# Altium schematic sheet NumatoConnection.SchDoc
size B
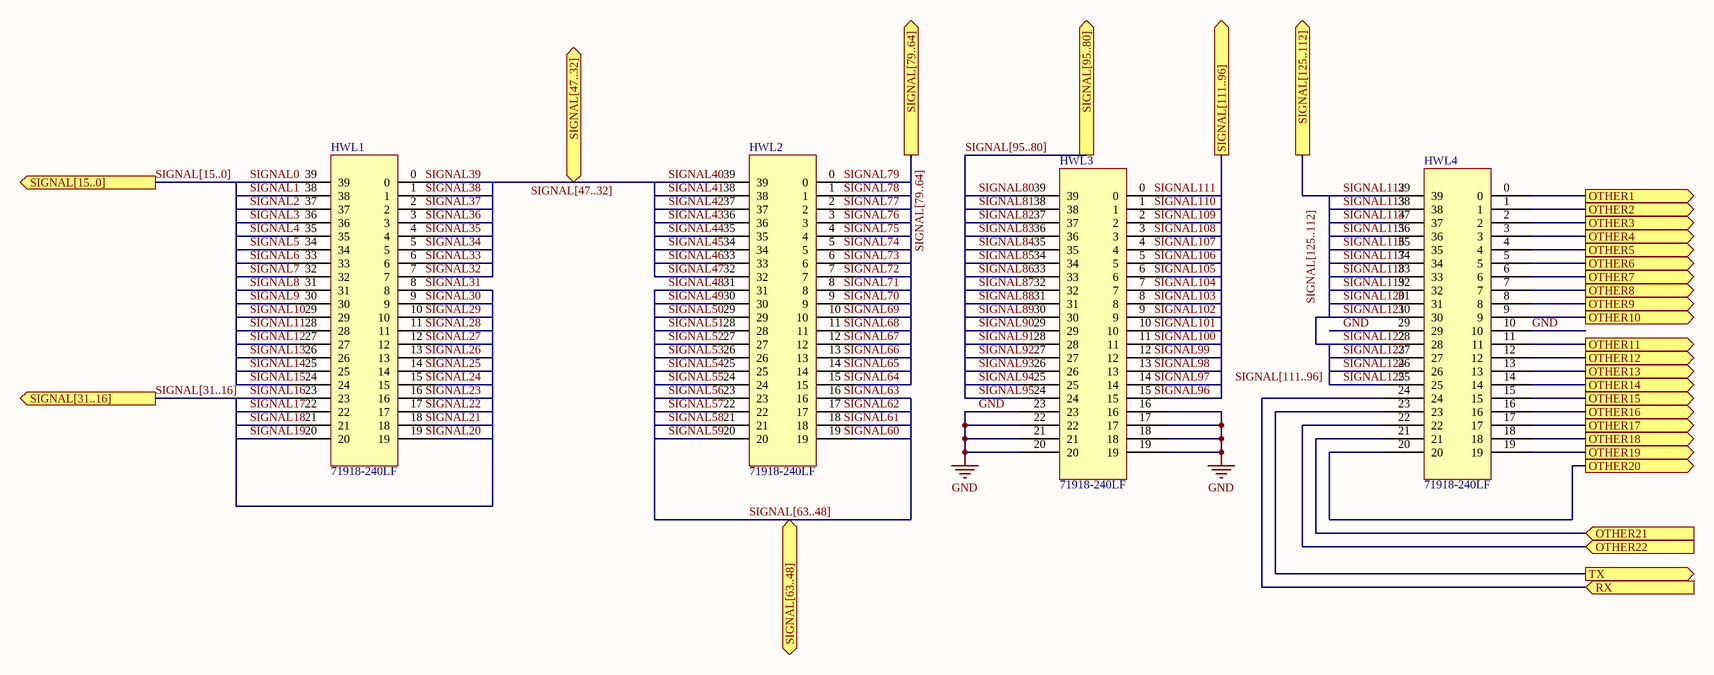
[diagram p0: NumatoConnection.SchDoc]

## Parts
HWL1  71918-240LF  [HWL_FP]
HWL2  71918-240LF  [HWL_FP]
HWL3  71918-240LF  [HWL_FP]
HWL4  71918-240LF  [HWL_FP]

## Ports
OTHER1 (out), OTHER2 (out), OTHER3 (out), OTHER4 (out), OTHER5 (out), OTHER6 (out), OTHER7 (out), OTHER8 (out), OTHER9 (out), OTHER10 (out), OTHER11 (out), OTHER12 (out), OTHER13 (out), OTHER14 (out), OTHER15 (out), OTHER16 (out), OTHER17 (out), OTHER18 (out), OTHER19 (out), OTHER20 (out), OTHER21 (in), OTHER22 (in), RX (in), SIGNAL[15..0] (out), SIGNAL[31..16] (out), SIGNAL[47..32] (out), SIGNAL[63..48] (out), SIGNAL[79..64] (out), SIGNAL[95..80] (out), SIGNAL[111..96] (out), SIGNAL[125..112] (out), TX (out)

## Nets
GND: HWL3.16 HWL3.17 HWL3.18 HWL3.19 HWL3.20 HWL3.21 HWL3.22 HWL3.23 HWL4.10 HWL4.29
OTHER1: HWL4.0 ; port OTHER1
OTHER2: HWL4.1 ; port OTHER2
OTHER3: HWL4.2 ; port OTHER3
OTHER4: HWL4.3 ; port OTHER4
OTHER5: HWL4.4 ; port OTHER5
OTHER6: HWL4.5 ; port OTHER6
OTHER7: HWL4.6 ; port OTHER7
OTHER8: HWL4.7 ; port OTHER8
OTHER9: HWL4.8 ; port OTHER9
OTHER10: HWL4.9 ; port OTHER10
OTHER11: HWL4.11 ; port OTHER11
OTHER12: HWL4.12 ; port OTHER12
OTHER13: HWL4.13 ; port OTHER13
OTHER14: HWL4.14 ; port OTHER14
OTHER15: HWL4.15 ; port OTHER15
OTHER16: HWL4.16 ; port OTHER16
OTHER17: HWL4.17 ; port OTHER17
OTHER18: HWL4.18 ; port OTHER18
OTHER19: HWL4.19 ; port OTHER19
OTHER20: HWL4.20 ; port OTHER20
OTHER21: HWL4.21 ; port OTHER21
OTHER22: HWL4.22 ; port OTHER22
RX: HWL4.24 ; port RX
SIGNAL0: HWL1.39
SIGNAL1: HWL1.38
SIGNAL2: HWL1.37
SIGNAL3: HWL1.36
SIGNAL4: HWL1.35
SIGNAL5: HWL1.34
SIGNAL6: HWL1.33
SIGNAL7: HWL1.32
SIGNAL8: HWL1.31
SIGNAL9: HWL1.30
SIGNAL10: HWL1.29
SIGNAL11: HWL1.28
SIGNAL12: HWL1.27
SIGNAL13: HWL1.26
SIGNAL14: HWL1.25
SIGNAL15: HWL1.24
SIGNAL16: HWL1.23
SIGNAL17: HWL1.22
SIGNAL18: HWL1.21
SIGNAL19: HWL1.20
SIGNAL40: HWL2.39
SIGNAL41: HWL2.38
SIGNAL42: HWL2.37
SIGNAL43: HWL2.36
SIGNAL44: HWL2.35
SIGNAL45: HWL2.34
SIGNAL46: HWL2.33
SIGNAL47: HWL2.32
SIGNAL48: HWL2.31
SIGNAL49: HWL2.30
SIGNAL50: HWL2.29
SIGNAL51: HWL2.28
SIGNAL52: HWL2.27
SIGNAL53: HWL2.26
SIGNAL54: HWL2.25
SIGNAL55: HWL2.24
SIGNAL56: HWL2.23
SIGNAL57: HWL2.22
SIGNAL58: HWL2.21
SIGNAL59: HWL2.20
SIGNAL80: HWL3.39
SIGNAL81: HWL3.38
SIGNAL82: HWL3.37
SIGNAL83: HWL3.36
SIGNAL84: HWL3.35
SIGNAL85: HWL3.34
SIGNAL86: HWL3.33
SIGNAL87: HWL3.32
SIGNAL88: HWL3.31
SIGNAL89: HWL3.30
SIGNAL90: HWL3.29
SIGNAL91: HWL3.28
SIGNAL92: HWL3.27
SIGNAL93: HWL3.26
SIGNAL94: HWL3.25
SIGNAL95: HWL3.24
SIGNAL112: HWL4.39
SIGNAL113: HWL4.38
SIGNAL114: HWL4.37
SIGNAL115: HWL4.36
SIGNAL116: HWL4.35
SIGNAL117: HWL4.34
SIGNAL118: HWL4.33
SIGNAL119: HWL4.32
SIGNAL120: HWL4.31
SIGNAL121: HWL4.30
SIGNAL122: HWL4.28
SIGNAL12~{3}: HWL4.27
SIGNAL124: HWL4.26
SIGNAL125: HWL4.25
TX: HWL4.23 ; port TX

Not connected (* = marked no-connect by the designer): HWL1 0 1 2 3 4 5 6 7 8 9 10 11 12 13 14 15 16 17 18 19; HWL2 0 1 2 3 4 5 6 7 8 9 10 11 12 13 14 15 16 17 18 19; HWL3 0 1 2 3 4 5 6 7 8 9 10 11 12 13 14 15

## Buses and harness runs
bus SIGNAL[15..0] = port SIGNAL[15..0]
bus SIGNAL[31..16] = port SIGNAL[31..16]
bus SIGNAL[47..32] = port SIGNAL[47..32]
bus SIGNAL[63..48] = port SIGNAL[63..48]
bus SIGNAL[79..64] = port SIGNAL[79..64]
bus SIGNAL[95..80] = port SIGNAL[95..80]
bus SIGNAL[111..96]
bus SIGNAL[125..112]

## Notes on the sheet
- Labels drawn without touching a wire or pin: SIGNAL20, SIGNAL21, SIGNAL22, SIGNAL23, SIGNAL24, SIGNAL25, SIGNAL26, SIGNAL27, SIGNAL28, SIGNAL29, SIGNAL30, SIGNAL31, SIGNAL32, SIGNAL33, SIGNAL34, SIGNAL35, SIGNAL36, SIGNAL37, SIGNAL38, SIGNAL39, SIGNAL60, SIGNAL61, SIGNAL62, SIGNAL63, SIGNAL64, SIGNAL65, SIGNAL66, SIGNAL67, SIGNAL68, SIGNAL69, SIGNAL70, SIGNAL71, SIGNAL72, SIGNAL73, SIGNAL74, SIGNAL75, SIGNAL76, SIGNAL77, SIGNAL78, SIGNAL79, SIGNAL96, SIGNAL97, SIGNAL98, SIGNAL99, SIGNAL100, SIGNAL101, SIGNAL102, SIGNAL103, SIGNAL104, SIGNAL105, SIGNAL106, SIGNAL107, SIGNAL108, SIGNAL109, SIGNAL110, SIGNAL111, SIGNAL[111..96], SIGNAL[125..112]

## Library data of the parts
HWL1-HWL4 = 71918-240LF: CONN HEADER 40POS DUAL VERT PCB; Manufacturer: FCI; Connector Type: Header, Shrouded; Number of Positions: 40; Number of Positions Loaded: All; Pitch: 0.100" (2.54mm); Supplier 1: Digi-Key; RoHS: RoHS Compliant; Stock 1: 126; Pricing 1: 1=1.85, 10=1.677, 50=1.5054, 100=1.437, 250=1.30016, 500=1.19752, 1000=1.02645, 2500=0.95802, 5000=0.91012 (USD); Packaging: Tube; Contact Type: Male Pin; Number of Rows: 2; Row Spacing: 0.100" (2.54mm); Contact Mating Length: 0.228" (5.80mm); Mounting Type: Through Hole; Termination: Solder; Fastening Type: Latch Lock/Eject Hooks; Features: Mounting Flange; Contact Finish: Gold, GXT™; Contact Finish Thickness: 30µin (0.76µm); Color: Gray; ComponentLink1URL: http://portal.fciconnect.com/Comergent//fci/drawing/71918.pdf; ComponentLink1Description: http://portal.fciconnect.com/Comergent//fci/drawing/71918.pdf; Supplier Part Number 1: 609-4497-ND; Category: Connectors, Interconnects; Manufacturer Part Number: 71918-240LF